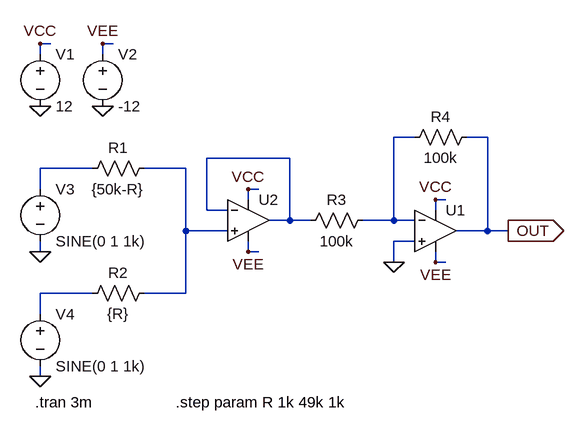
[diagram p0: schematic Dry_Wet_Buffered_Test_01.asc]
Dry_Wet_Buffered_Test_01.asc, the LTspice schematic file:
Version 4
SHEET 1 880 680
WIRE 0 -112 -16 -112
WIRE 96 -112 80 -112
WIRE -16 -96 -16 -112
WIRE 80 -96 80 -112
WIRE 560 32 528 32
WIRE 672 32 640 32
WIRE 368 64 240 64
WIRE 64 80 -16 80
WIRE 208 80 144 80
WIRE -16 112 -16 80
WIRE 320 112 304 112
WIRE 304 128 304 112
WIRE 608 128 592 128
WIRE 240 144 240 64
WIRE 272 144 240 144
WIRE 592 144 592 128
WIRE 368 160 368 64
WIRE 368 160 336 160
WIRE 400 160 368 160
WIRE 528 160 528 32
WIRE 528 160 480 160
WIRE 560 160 528 160
WIRE 208 176 208 80
WIRE 272 176 208 176
WIRE 672 176 672 32
WIRE 672 176 624 176
WIRE 704 176 672 176
WIRE 560 192 528 192
WIRE -16 208 -16 192
WIRE 304 208 304 192
WIRE 320 208 304 208
WIRE 528 224 528 192
WIRE 592 224 592 208
WIRE 608 224 592 224
WIRE 64 272 -16 272
WIRE 208 272 208 176
WIRE 208 272 144 272
WIRE -16 304 -16 272
WIRE -16 400 -16 384
FLAG 592 128 VCC
FLAG 592 224 VEE
FLAG 528 224 0
FLAG 704 176 OUT
IOPIN 704 176 Out
FLAG -16 -16 0
FLAG 80 -16 0
FLAG -16 -112 VCC
FLAG 80 -112 VEE
FLAG -16 208 0
FLAG -16 400 0
FLAG 304 112 VCC
FLAG 304 208 VEE
SYMBOL res 160 64 R90
WINDOW 0 0 56 VBottom 2
WINDOW 3 32 56 VTop 2
SYMATTR InstName R1
SYMATTR Value {50k-R}
SYMBOL res 160 256 R90
WINDOW 0 0 56 VBottom 2
WINDOW 3 32 56 VTop 2
SYMATTR InstName R2
SYMATTR Value {R}
SYMBOL res 496 144 R90
WINDOW 0 0 56 VBottom 2
WINDOW 3 32 56 VTop 2
SYMATTR InstName R3
SYMATTR Value 100k
SYMBOL Opamps\\UniversalOpamp2 592 176 R0
SYMATTR InstName U1
SYMBOL res 656 16 R90
WINDOW 0 0 56 VBottom 2
WINDOW 3 32 56 VTop 2
SYMATTR InstName R4
SYMATTR Value 100k
SYMBOL voltage -16 -112 R0
WINDOW 123 0 0 Left 0
WINDOW 39 0 0 Left 0
SYMATTR InstName V1
SYMATTR Value 12
SYMBOL voltage 80 -112 R0
WINDOW 123 0 0 Left 0
WINDOW 39 0 0 Left 0
SYMATTR InstName V2
SYMATTR Value -12
SYMBOL voltage -16 96 R0
WINDOW 123 0 0 Left 0
WINDOW 39 0 0 Left 0
SYMATTR InstName V3
SYMATTR Value SINE(0 1 1k)
SYMBOL voltage -16 288 R0
WINDOW 123 0 0 Left 0
WINDOW 39 0 0 Left 0
SYMATTR InstName V4
SYMATTR Value SINE(0 1 1k)
SYMBOL Opamps\\UniversalOpamp2 304 160 R0
SYMATTR InstName U2
TEXT -24 440 Left 2 !.tran 3m
TEXT 192 440 Left 2 !.step param R 1k 49k 1k

The netlist it stands for:
* Dry_Wet_Buffered_Test_01.asc
R1 N004 N003 {50k-R}
R2 N004 N005 {R}
R3 N001 N002 100k
XU1 0 N001 VCC VEE OUT level.2 Avol=1Meg GBW=10Meg Slew=10Meg ilimit=25m rail=0 Vos=0 phimargin=45 en=0 enk=0 in=0 ink=0 Rin=500Meg  ; pins IN+ IN- V+ V- OUT
R4 OUT N001 100k
V1 VCC 0 12
V2 VEE 0 -12
V3 N003 0 SINE(0 1 1k)
V4 N005 0 SINE(0 1 1k)
XU2 N004 N002 VCC VEE N002 level.2 Avol=1Meg GBW=10Meg Slew=10Meg ilimit=25m rail=0 Vos=0 phimargin=45 en=0 enk=0 in=0 ink=0 Rin=500Meg  ; pins IN+ IN- V+ V- OUT
.tran 3m
.step param R 1k 49k 1k
.lib UniversalOpamps2.sub
.backanno
.end